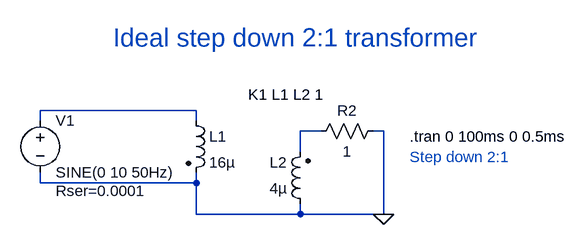
[diagram p0: schematic Transformer-step-down-2-1.asc]
Transformer-step-down-2-1.asc, the LTspice schematic file:
Version 4.1
SHEET 1 880 680
WIRE 240 96 240 112
WIRE 400 144 400 160
WIRE 512 32 528 32
WIRE 0 96 0 112
WIRE 240 112 240 160
WIRE 240 160 400 160
WIRE 240 112 0 112
WIRE 400 160 528 160
WIRE 528 160 528 32
FLAG 528 160 0
WIRE 240 16 240 0
WIRE 0 16 0 0
WIRE 240 0 0 0
WIRE 400 64 400 48
WIRE 432 32 416 32
WIRE 400 48 400 32
WIRE 400 32 416 32
SYMBOL voltage 0 0 R0
WINDOW 123 0 0 Left 2
WINDOW 39 24 124 Left 2
SYMATTR SpiceLine Rser=0.0001
SYMATTR InstName V1
SYMATTR Value SINE(0 10 50Hz)
SYMBOL ind2 224 0 R0
SYMATTR InstName L1
SYMATTR Value 16µ
SYMATTR Type ind
SYMBOL ind2 416 160 R180
WINDOW 0 36 80 Left 2
WINDOW 3 36 40 Left 2
SYMATTR InstName L2
SYMATTR Value 4µ
SYMATTR Type ind
SYMBOL res 528 16 R90
WINDOW 0 0 56 VBottom 2
WINDOW 3 32 56 VTop 2
SYMATTR InstName R2
SYMATTR Value 1
TEXT 320 -24 Left 2 !K1 L1 L2 1
TEXT 568 40 Left 2 !.tran 0 100ms 0 0.5ms
TEXT 568 72 Left 2 ;Step down 2:1
TEXT 112 -112 Left 4 ;Ideal step down 2:1 transformer

The netlist it stands for:
* Transformer-step-down-2-1.asc
V1 N001 0 SINE(0 10 50Hz) Rser=0.0001
L1 N001 0 16µ
L2 0 N002 4µ
R2 0 N002 1
K1 L1 L2 1
.tran 0 100ms 0 0.5ms
* Step down 2:1
* Ideal step down 2:1 transformer
.backanno
.end